# Altium schematic sheet Output_amplifier.SchDoc: DAC output amplifier
size A4; Date: 6.4.2015; Engineer: Matjaž Tome; Revision: B; SheetNumber: 8; SheetTotal: 10; Project: USB DAQ
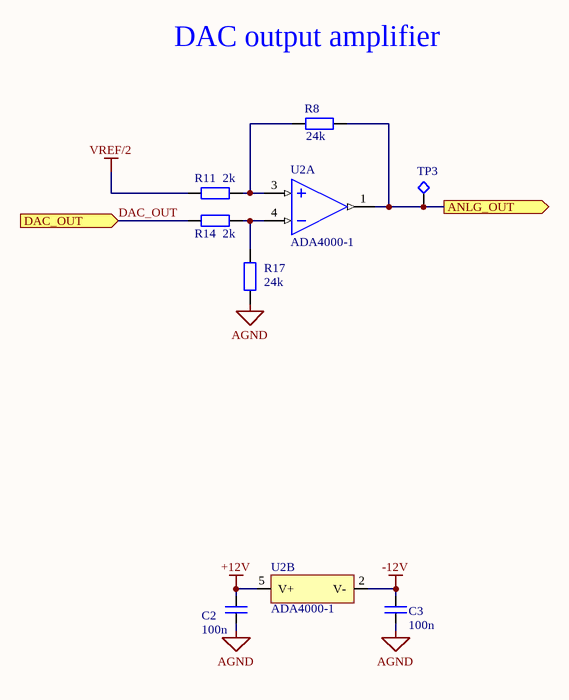
[diagram p0: Output_amplifier.SchDoc]

## Parts
C2  100n  [C_0603]
C3  100n  [C_0603]
R8  value 24k  [R_0603]  (hidden comment: comment)
R11  value 2k  [R_0603]  (hidden comment: comment)
R14  value 2k  [R_0603]  (hidden comment: comment)
R17  value 24k  [R_0603]  (hidden comment: comment)
TP3  testpoint  [TP1_FULL]  (value not drawn)
U2  ADA4000-1  [SOT23-5]  (parts A,B of 2)

## Ports
ANLG_OUT (out), DAC_OUT (in)

## Nets
+12V: C2.1 U2.5(V+)
-12V: C3.1 U2.2(V-)
AGND: C2.2 C3.2 R17.1
VREF/2: R11.1
ANLG_OUT: R8.2 TP3.1 U2.1(OUT) ; port ANLG_OUT
DAC_OUT: R14.1 ; port DAC_OUT
NetR8_1: R8.1 R11.2 U2.3(IN+)
NetR14_2: R14.2 R17.2 U2.4(IN-)

## Notes on the sheet
- DAC output amplifier
- Title
- Date
- Project
- Rev
- Engineer
- Sheet
- of

## Library data of the parts
C2 C3 = Capacitor: Generic capacitor; Value: 100n
R8 R11 R14 R17 = Resistor: Generic resistor
TP3 = Test Point: testpoint 1.5mm diameter no hole; Part Number: XXC0006; Category: testpoints
U2 = ADA4000-1: Operational Amplifier, Single, 1 Amplifier, 5 MHz, 20 V/µs, ± 4V to ± 18V, TSOT, 5 Pins; Part Number: XOG0003; Manufacturer: Analog devices; Manufacturer Number: ADA4000-1AUJZ-R7; Dealer number: 2461002; Dealer: Farnell; Supply voltage max: +-18V; Devices: 1; Category: Integrated circuits; Price: 1.97; Case: SOT; Technology: SMT; HelpURL: https://www.farnell.com/datasheets/698265.pdf